# EAGLE board Wordclock (EAGLE 7.2.0), part 1 of 2
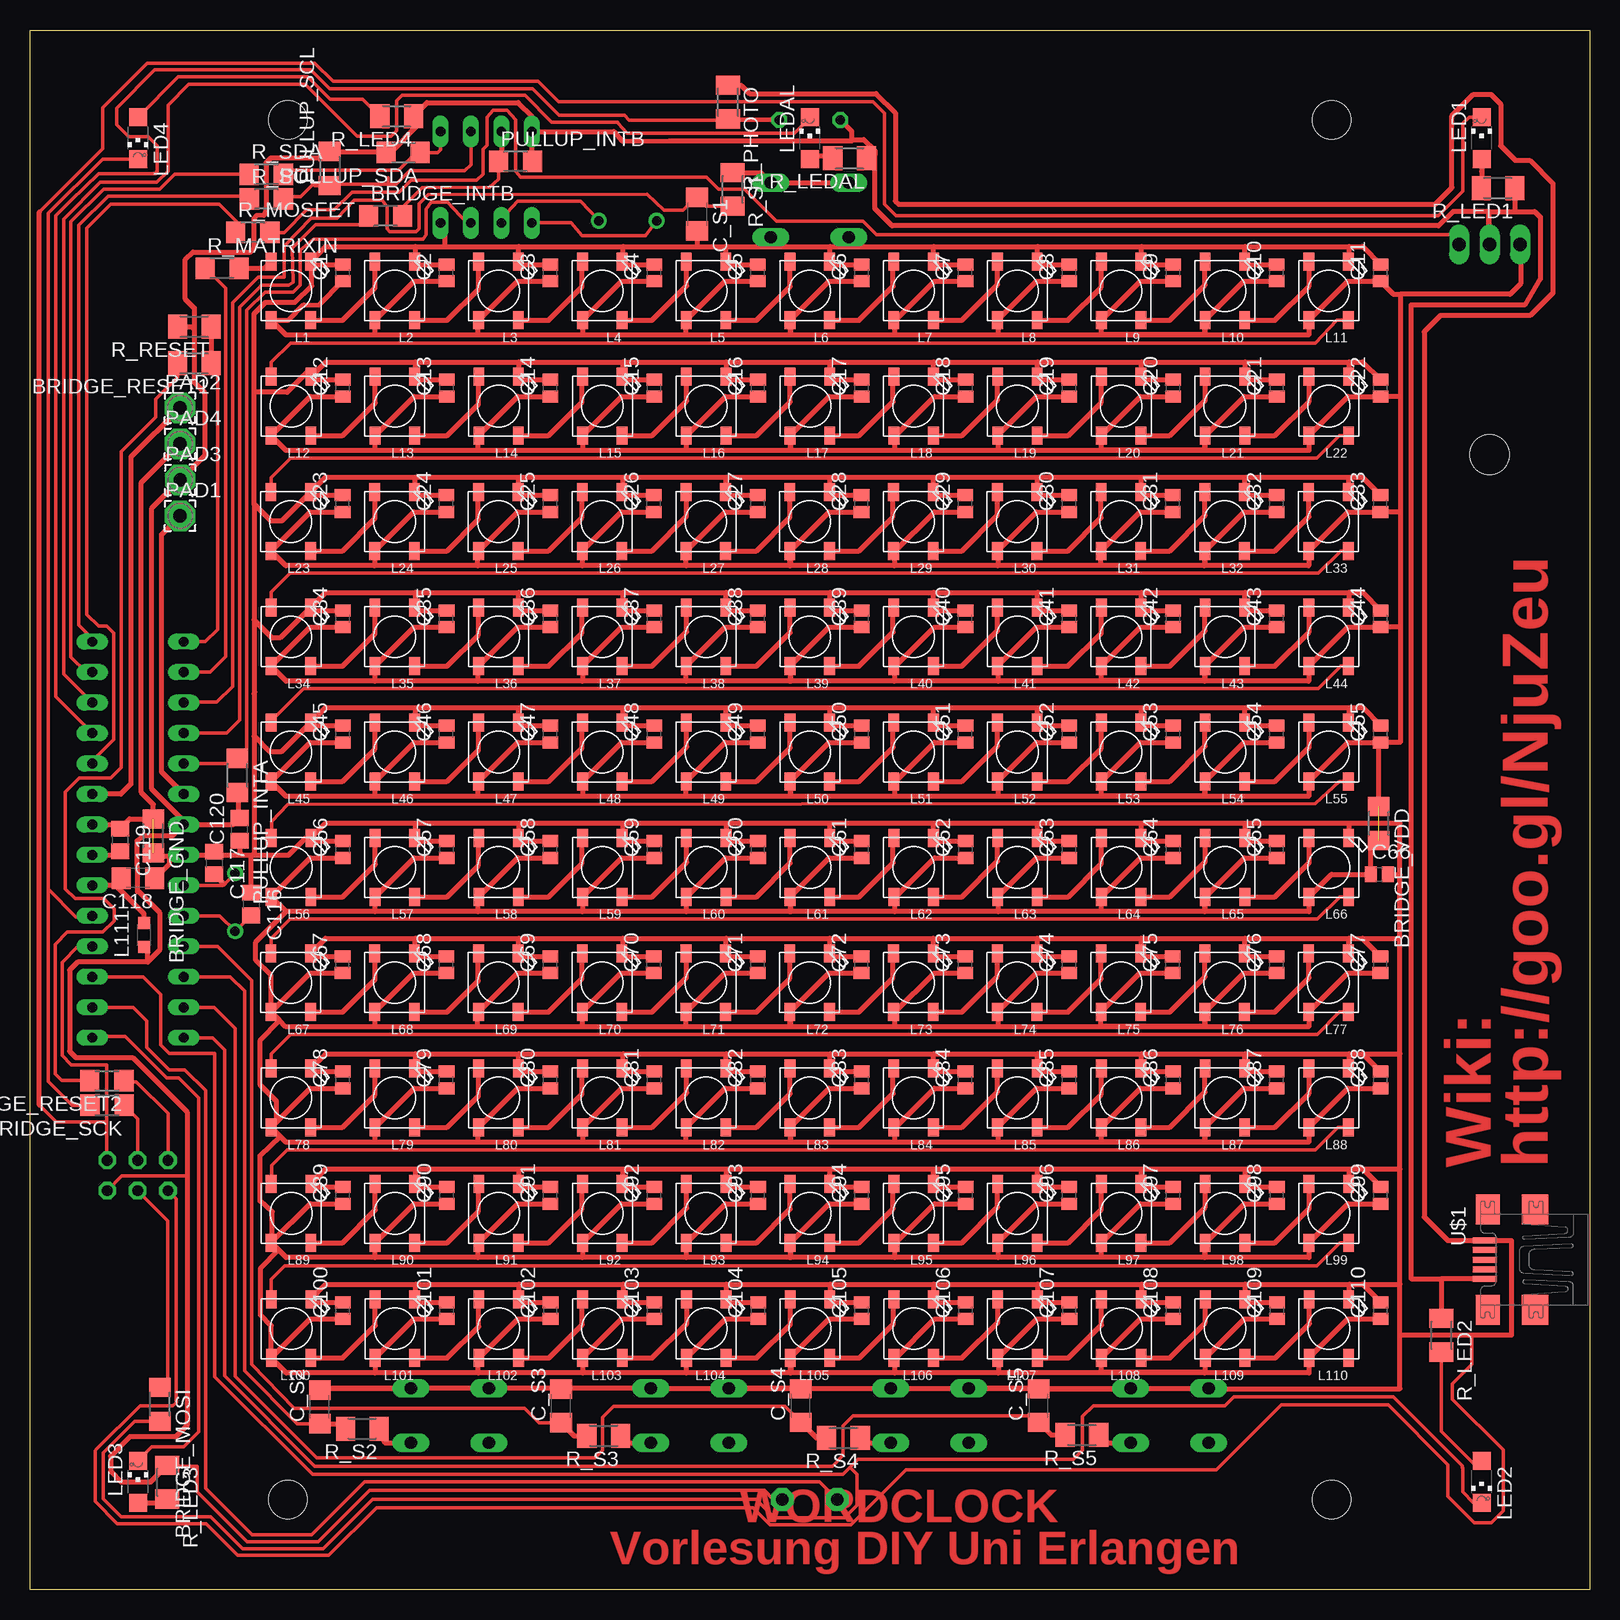
[diagram p1: board, top side]
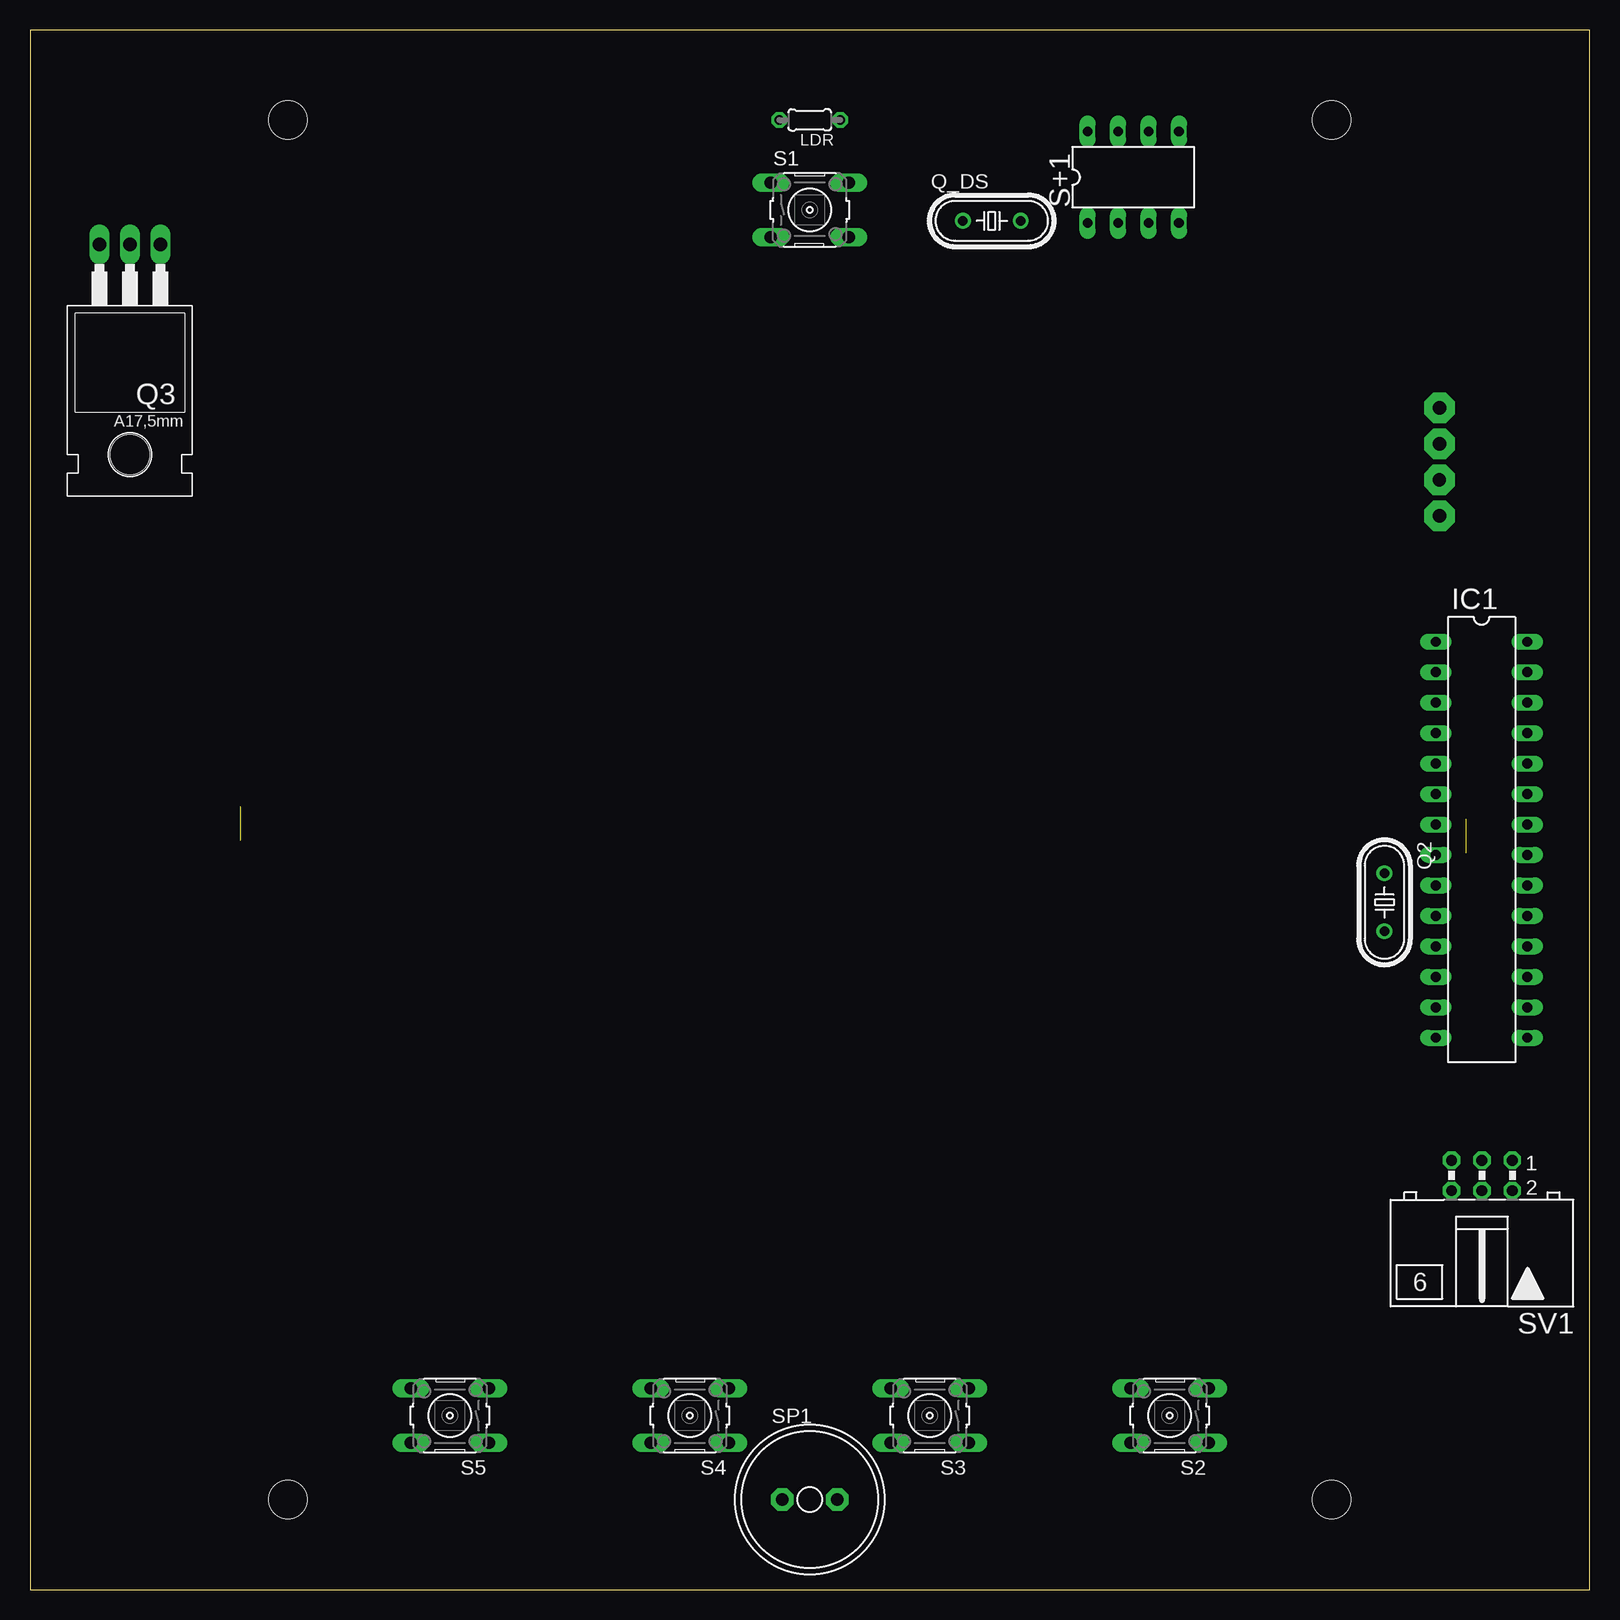
[diagram p2: board, bottom side, seen from below]

Size 130 x 130 mm. Coordinates in mm from the lower left corner, seen from the top.
Outline: 0,0 0,130 130,130 130,0 0,0
Copper layers (1*16): Top 0.035mm / dielectric 1.5mm / Bottom 0.035mm
Design rules "default *": minimum track width 10mil, minimum drill 24mil, track to track 10mil, track to pad 10mil, pad to pad 10mil, via to via 10mil, smd to smd 8mil, copper to edge 30mil, drill to drill 8mil, minimum pad ring 10mil, minimum via ring 8mil, stop-mask expansion 4mil, vias tented up to drill 0mil, thermal gap 10mil
Holes 3.2 mm at 21.5,122.5 108.5,7.5 21.5,7.5 108.5,122.5

## Footprints (pad centres in the part's own frame; a part is rotated, then mirrored left to right if it is on the bottom)
R1206 = smd 1.6 x 1.803: 1 -1.422,0; 2 1.422,0
M1206 = smd 1.6 x 2: 1 -1.4,0; 2 1.4,0
C1310 = smd 1 x 1.3: 1 -0.7,0; 2 0.7,0
C0805 = smd 1.3 x 1.5: 1 -0.95,0; 2 0.95,0
C1206 = smd 1.6 x 1.8: 1 -1.4,0; 2 1.4,0
DIL28-3 = drill 0.813 long: 1 -16.51,-3.81; 2 -13.97,-3.81; 3 -11.43,-3.81; 4 -8.89,-3.81; 5 -6.35,-3.81; 6 -3.81,-3.81; 7 -1.27,-3.81; 8 1.27,-3.81; 9 3.81,-3.81; 10 6.35,-3.81; 11 8.89,-3.81; 12 11.43,-3.81; 13 13.97,-3.81; 14 16.51,-3.81; 15 16.51,3.81; 16 13.97,3.81; 17 11.43,3.81; 18 8.89,3.81; 19 6.35,3.81; 20 3.81,3.81; 21 1.27,3.81; 22 -1.27,3.81; 23 -3.81,3.81; 24 -6.35,3.81; 25 -8.89,3.81; 26 -11.43,3.81; 27 -13.97,3.81; 28 -16.51,3.81
WS2812B = smd 1.5 x 0.9: 1-VDD 2.45,-1.65; 2-DOUT 2.45,1.65; 3-GND -2.45,1.65; 4-DIN -2.45,-1.65
L2012C = smd 1 x 1: 1 -1,0; 2 1,0
0204/5 = drill 0.813 octagon: 1 -2.54,0; 2 2.54,0
CHIPLED_1206 = smd 1.5 x 1.5: A 0,-1.75; C 0,1.75
2,54/1,1 = drill 1.118 pad 2.54 octagon: 1 0,0
HC49/S = drill 0.813: 1 -2.413,0; 2 2.413,0
TO220 = drill 1.118 long: 1 -2.54,-6.35; 2 0,-6.35; 3 2.54,-6.35 | hole 3.302: 0,11.176
B3F-10XX = drill 1.016 long: 1 -3.251,2.261; 2 3.251,2.261; 3 -3.251,-2.261; 4 3.251,-2.261
DIL8 = drill 0.813 long: 1 -3.81,-3.81; 2 -1.27,-3.81; 3 1.27,-3.81; 4 3.81,-3.81; 5 3.81,3.81; 6 1.27,3.81; 7 -1.27,3.81; 8 -3.81,3.81
AL11P = drill 1.016 pad 1.905 octagon: + 2.286,0; - -2.286,0
ML6L = drill 0.914 octagon: 1 -2.54,-1.27; 2 -2.54,1.27; 3 0,-1.27; 4 0,1.27; 5 2.54,-1.27; 6 2.54,1.27
MINI-USB = smd 2 x 0.5: 1 2.25,1.6; 2 2.25,0.8; 3 2.25,0; 4 2.25,-0.8; 5 2.25,-1.6 | smd 2.2 x 2.5: M1 -1.95,-4.2; M2 -1.95,4.2 | smd 2 x 2.5: M3 2,4.2; M4 2,-4.2

## Placement (x,y rotation side)
BRIDGE_GND  0  [R1206]  10.29,62.81 270 top
BRIDGE_INTB  0  [R1206]  29.65,114.5 0 top
BRIDGE_MOSI  0  [R1206]  10.83,15.44 270 top
BRIDGE_RESET1  0  [M1206]  13.7,102.22 180 top
BRIDGE_RESET2  0  [R1206]  6.41,42.42 180 top
BRIDGE_SCK  0  [R1206]  6.42,40.36 180 top
BRIDGE_VDD  0  [R1206]  112.43,63.85 270 top
C1  100n  [C1310]  26.07,109.75 90 top
C2  100n  [C1310]  34.73,109.75 90 top
C3  100n  [C1310]  43.38,109.75 90 top
C4  100n  [C1310]  52.02,109.75 90 top
C5  100n  [C1310]  60.67,109.75 90 top
C6  100n  [C1310]  69.33,109.75 90 top
C7  100n  [C1310]  77.97,109.75 90 top
C8  100n  [C1310]  86.62,109.75 90 top
C9  100n  [C1310]  95.28,109.75 90 top
C10  100n  [C1310]  103.92,109.75 90 top
C11  100n  [C1310]  112.58,109.75 90 top
C12  100n  [C1310]  26.09,100.14 90 top
C13  100n  [C1310]  34.73,100.14 90 top
C14  100n  [C1310]  43.38,100.14 90 top
C15  100n  [C1310]  52.03,100.14 90 top
C16  100n  [C1310]  60.69,100.14 90 top
C17  100n  [C1310]  69.33,100.14 90 top
C18  100n  [C1310]  77.98,100.14 90 top
C19  100n  [C1310]  86.64,100.14 90 top
C20  100n  [C1310]  95.28,100.14 90 top
C21  100n  [C1310]  103.94,100.14 90 top
C22  100n  [C1310]  112.58,100.14 90 top
C23  100n  [C1310]  26.07,90.53 90 top
C24  100n  [C1310]  34.72,90.53 90 top
C25  100n  [C1310]  43.37,90.53 90 top
C26  100n  [C1310]  52.02,90.53 90 top
C27  100n  [C1310]  60.66,90.53 90 top
C28  100n  [C1310]  69.31,90.53 90 top
C29  100n  [C1310]  77.97,90.53 90 top
C30  100n  [C1310]  86.61,90.53 90 top
C31  100n  [C1310]  95.27,90.53 90 top
C32  100n  [C1310]  103.92,90.53 90 top
C33  100n  [C1310]  112.56,90.53 90 top
C34  100n  [C1310]  26.07,80.92 90 top
C35  100n  [C1310]  34.73,80.92 90 top
C36  100n  [C1310]  43.38,80.92 90 top
C37  100n  [C1310]  52.02,80.92 90 top
C38  100n  [C1310]  60.67,80.92 90 top
C39  100n  [C1310]  69.33,80.92 90 top
C40  100n  [C1310]  77.97,80.92 90 top
C41  100n  [C1310]  86.62,80.92 90 top
C42  100n  [C1310]  95.28,80.92 90 top
C43  100n  [C1310]  103.92,80.92 90 top
C44  100n  [C1310]  112.58,80.92 90 top
C45  100n  [C1310]  26.07,71.31 90 top
C46  100n  [C1310]  34.73,71.31 90 top
C47  100n  [C1310]  43.38,71.31 90 top
C48  100n  [C1310]  52.02,71.31 90 top
C49  100n  [C1310]  60.67,71.31 90 top
C50  100n  [C1310]  69.33,71.31 90 top
C51  100n  [C1310]  77.97,71.31 90 top
C52  100n  [C1310]  86.62,71.31 90 top
C53  100n  [C1310]  95.28,71.31 90 top
C54  100n  [C1310]  103.92,71.31 90 top
C55  100n  [C1310]  112.58,71.31 90 top
C56  100n  [C1310]  26.09,61.69 90 top
C57  100n  [C1310]  34.73,61.69 90 top
C58  100n  [C1310]  43.38,61.69 90 top
C59  100n  [C1310]  52.03,61.69 90 top
C60  100n  [C1310]  60.69,61.69 90 top
C61  100n  [C1310]  69.33,61.69 90 top
C62  100n  [C1310]  77.98,61.69 90 top
C63  100n  [C1310]  86.64,61.69 90 top
C64  100n  [C1310]  95.28,61.69 90 top
C65  100n  [C1310]  103.94,61.69 90 top
C66  100n  [C1310]  112.47,59.62 0 top
C67  100n  [C1310]  26.07,52.09 90 top
C68  100n  [C1310]  34.72,52.09 90 top
C69  100n  [C1310]  43.37,52.09 90 top
C70  100n  [C1310]  52.02,52.09 90 top
C71  100n  [C1310]  60.66,52.09 90 top
C72  100n  [C1310]  69.31,52.09 90 top
C73  100n  [C1310]  77.97,52.09 90 top
C74  100n  [C1310]  86.61,52.09 90 top
C75  100n  [C1310]  95.27,52.09 90 top
C76  100n  [C1310]  103.92,52.09 90 top
C77  100n  [C1310]  112.56,52.09 90 top
C78  100n  [C1310]  26.07,42.47 90 top
C79  100n  [C1310]  34.73,42.47 90 top
C80  100n  [C1310]  43.38,42.47 90 top
C81  100n  [C1310]  52.02,42.47 90 top
C82  100n  [C1310]  60.67,42.47 90 top
C83  100n  [C1310]  69.33,42.47 90 top
C84  100n  [C1310]  77.97,42.47 90 top
C85  100n  [C1310]  86.62,42.47 90 top
C86  100n  [C1310]  95.28,42.47 90 top
C87  100n  [C1310]  103.92,42.47 90 top
C88  100n  [C1310]  112.58,42.47 90 top
C89  100n  [C1310]  26.09,32.87 90 top
C90  100n  [C1310]  34.73,32.87 90 top
C91  100n  [C1310]  43.38,32.87 90 top
C92  100n  [C1310]  52.03,32.87 90 top
C93  100n  [C1310]  60.69,32.87 90 top
C94  100n  [C1310]  69.33,32.87 90 top
C95  100n  [C1310]  77.98,32.87 90 top
C96  100n  [C1310]  86.64,32.87 90 top
C97  100n  [C1310]  95.28,32.87 90 top
C98  100n  [C1310]  103.94,32.87 90 top
C99  100n  [C1310]  112.58,32.87 90 top
C100  100n  [C1310]  26.09,23.25 90 top
C101  100n  [C1310]  34.74,23.25 90 top
C102  100n  [C1310]  43.4,23.25 90 top
C103  100n  [C1310]  52.05,23.25 90 top
C104  100n  [C1310]  60.7,23.25 90 top
C105  100n  [C1310]  69.34,23.25 90 top
C106  100n  [C1310]  78,23.25 90 top
C107  100n  [C1310]  86.64,23.25 90 top
C108  100n  [C1310]  95.3,23.25 90 top
C109  100n  [C1310]  103.94,23.25 90 top
C110  100n  [C1310]  112.59,23.25 90 top
C116  15p  [C0805]  18.44,57.14 270 top
C117  15p  [C0805]  15.36,60.56 270 top
C118  100n  [C1206]  9,59.3 180 top
C119  100n  [C0805]  7.5,62.48 270 top
C120  100n  [C0805]  17.47,63.36 90 top
C_S1  100n  [C1206]  55.6,114.65 270 top
C_S2  100n  [C1206]  24.15,15.23 90 top
C_S3  100n  [C1206]  44.27,15.31 90 top
C_S4  100n  [C1206]  64.25,15.34 90 top
C_S5  100n  [C1206]  84.08,15.33 90 top
IC1  MEGA8-P  [DIL28-3]  9,62.5 270 bottom
L1  WS2812B  [WS2812B]  21.75,108.25 270 top
L2  WS2812B  [WS2812B]  30.4,108.25 270 top
L3  WS2812B  [WS2812B]  39.05,108.25 270 top
L4  WS2812B  [WS2812B]  47.7,108.25 270 top
L5  WS2812B  [WS2812B]  56.35,108.25 270 top
L6  WS2812B  [WS2812B]  65,108.25 270 top
L7  WS2812B  [WS2812B]  73.65,108.25 270 top
L8  WS2812B  [WS2812B]  82.3,108.25 270 top
L9  WS2812B  [WS2812B]  90.95,108.25 270 top
L10  WS2812B  [WS2812B]  99.6,108.25 270 top
L11  WS2812B  [WS2812B]  108.25,108.25 270 top
L12  WS2812B  [WS2812B]  21.76,98.64 270 top
L13  WS2812B  [WS2812B]  30.41,98.64 270 top
L14  WS2812B  [WS2812B]  39.06,98.64 270 top
L15  WS2812B  [WS2812B]  47.71,98.64 270 top
L16  WS2812B  [WS2812B]  56.36,98.64 270 top
L17  WS2812B  [WS2812B]  65.01,98.64 270 top
L18  WS2812B  [WS2812B]  73.66,98.64 270 top
L19  WS2812B  [WS2812B]  82.31,98.64 270 top
L20  WS2812B  [WS2812B]  90.96,98.64 270 top
L21  WS2812B  [WS2812B]  99.61,98.64 270 top
L22  WS2812B  [WS2812B]  108.26,98.64 270 top
L23  WS2812B  [WS2812B]  21.74,89.03 270 top
L24  WS2812B  [WS2812B]  30.39,89.03 270 top
L25  WS2812B  [WS2812B]  39.04,89.03 270 top
L26  WS2812B  [WS2812B]  47.69,89.03 270 top
L27  WS2812B  [WS2812B]  56.34,89.03 270 top
L28  WS2812B  [WS2812B]  64.99,89.03 270 top
L29  WS2812B  [WS2812B]  73.64,89.03 270 top
L30  WS2812B  [WS2812B]  82.29,89.03 270 top
L31  WS2812B  [WS2812B]  90.94,89.03 270 top
L32  WS2812B  [WS2812B]  99.59,89.03 270 top
L33  WS2812B  [WS2812B]  108.24,89.03 270 top
L34  WS2812B  [WS2812B]  21.75,79.42 270 top
L35  WS2812B  [WS2812B]  30.4,79.42 270 top
L36  WS2812B  [WS2812B]  39.05,79.42 270 top
L37  WS2812B  [WS2812B]  47.7,79.42 270 top
L38  WS2812B  [WS2812B]  56.35,79.42 270 top
L39  WS2812B  [WS2812B]  65,79.42 270 top
L40  WS2812B  [WS2812B]  73.65,79.42 270 top
L41  WS2812B  [WS2812B]  82.3,79.42 270 top
L42  WS2812B  [WS2812B]  90.95,79.42 270 top
L43  WS2812B  [WS2812B]  99.6,79.42 270 top
L44  WS2812B  [WS2812B]  108.25,79.42 270 top
L45  WS2812B  [WS2812B]  21.75,69.81 270 top
L46  WS2812B  [WS2812B]  30.4,69.81 270 top
L47  WS2812B  [WS2812B]  39.05,69.81 270 top
L48  WS2812B  [WS2812B]  47.7,69.81 270 top
L49  WS2812B  [WS2812B]  56.35,69.81 270 top
L50  WS2812B  [WS2812B]  65,69.81 270 top
L51  WS2812B  [WS2812B]  73.65,69.81 270 top
L52  WS2812B  [WS2812B]  82.3,69.81 270 top
L53  WS2812B  [WS2812B]  90.95,69.81 270 top
L54  WS2812B  [WS2812B]  99.6,69.81 270 top
L55  WS2812B  [WS2812B]  108.25,69.81 270 top
L56  WS2812B  [WS2812B]  21.76,60.19 270 top
L57  WS2812B  [WS2812B]  30.41,60.19 270 top
L58  WS2812B  [WS2812B]  39.06,60.19 270 top
L59  WS2812B  [WS2812B]  47.71,60.19 270 top
L60  WS2812B  [WS2812B]  56.36,60.19 270 top
L61  WS2812B  [WS2812B]  65.01,60.19 270 top
L62  WS2812B  [WS2812B]  73.66,60.19 270 top
L63  WS2812B  [WS2812B]  82.31,60.19 270 top
L64  WS2812B  [WS2812B]  90.96,60.19 270 top
L65  WS2812B  [WS2812B]  99.61,60.19 270 top
L66  WS2812B  [WS2812B]  108.26,60.19 270 top
L67  WS2812B  [WS2812B]  21.74,50.59 270 top
L68  WS2812B  [WS2812B]  30.39,50.59 270 top
L69  WS2812B  [WS2812B]  39.04,50.59 270 top
L70  WS2812B  [WS2812B]  47.69,50.59 270 top
L71  WS2812B  [WS2812B]  56.34,50.59 270 top
L72  WS2812B  [WS2812B]  64.99,50.59 270 top
L73  WS2812B  [WS2812B]  73.64,50.59 270 top
L74  WS2812B  [WS2812B]  82.29,50.59 270 top
L75  WS2812B  [WS2812B]  90.94,50.59 270 top
L76  WS2812B  [WS2812B]  99.59,50.59 270 top
L77  WS2812B  [WS2812B]  108.24,50.59 270 top
L78  WS2812B  [WS2812B]  21.75,40.97 270 top
L79  WS2812B  [WS2812B]  30.4,40.97 270 top
L80  WS2812B  [WS2812B]  39.05,40.97 270 top
L81  WS2812B  [WS2812B]  47.7,40.97 270 top
L82  WS2812B  [WS2812B]  56.35,40.97 270 top
L83  WS2812B  [WS2812B]  65,40.97 270 top
L84  WS2812B  [WS2812B]  73.65,40.97 270 top
L85  WS2812B  [WS2812B]  82.3,40.97 270 top
L86  WS2812B  [WS2812B]  90.95,40.97 270 top
L87  WS2812B  [WS2812B]  99.6,40.97 270 top
L88  WS2812B  [WS2812B]  108.25,40.97 270 top
L89  WS2812B  [WS2812B]  21.76,31.37 270 top
L90  WS2812B  [WS2812B]  30.41,31.37 270 top
L91  WS2812B  [WS2812B]  39.06,31.37 270 top
L92  WS2812B  [WS2812B]  47.71,31.37 270 top
L93  WS2812B  [WS2812B]  56.36,31.37 270 top
L94  WS2812B  [WS2812B]  65.01,31.37 270 top
L95  WS2812B  [WS2812B]  73.66,31.37 270 top
L96  WS2812B  [WS2812B]  82.31,31.37 270 top
L97  WS2812B  [WS2812B]  90.96,31.37 270 top
L98  WS2812B  [WS2812B]  99.61,31.37 270 top
L99  WS2812B  [WS2812B]  108.26,31.37 270 top
L100  WS2812B  [WS2812B]  21.77,21.75 270 top
L101  WS2812B  [WS2812B]  30.42,21.75 270 top
L102  WS2812B  [WS2812B]  39.07,21.75 270 top
L103  WS2812B  [WS2812B]  47.72,21.75 270 top
L104  WS2812B  [WS2812B]  56.37,21.75 270 top
L105  WS2812B  [WS2812B]  65.02,21.75 270 top
L106  WS2812B  [WS2812B]  73.67,21.75 270 top
L107  WS2812B  [WS2812B]  82.32,21.75 270 top
L108  WS2812B  [WS2812B]  90.97,21.75 270 top
L109  WS2812B  [WS2812B]  99.62,21.75 270 top
L110  WS2812B  [WS2812B]  108.27,21.75 270 top
L111  10u  [L2012C]  9.52,54.56 90 top
LDR  [0204/5]  65,122.5 180 bottom
LED1  [CHIPLED_1206]  121,121 0 top
LED2  [CHIPLED_1206]  121,9 180 top
LED3  [CHIPLED_1206]  9,9 0 top
LED4  [CHIPLED_1206]  9,121 180 top
LEDAL  [CHIPLED_1206]  65,121 0 top
PAD1  [2,54/1,1]  12.51,89.5 0 top
PAD2  [2,54/1,1]  12.5,98.5 0 top
PAD3  [2,54/1,1]  12.52,92.5 0 top
PAD4  [2,54/1,1]  12.51,95.51 0 top
PULLUP_INTA  4,7k  [R1206]  17.3,67.87 270 top
PULLUP_INTB  4,7k  [R1206]  40.48,119.03 0 top
PULLUP_SCL  4,7k  [R1206]  24.98,118.45 90 top
PULLUP_SDA  4,7k  [R1206]  31.1,119.78 180 top
Q2  [HC49/S]  17.09,57.29 270 bottom
Q3  SUP75N06-08  [TO220]  121.67,105.77 180 bottom
Q_DS  32,768MHz  [HC49/S]  49.83,114.09 0 bottom
R_LED1  120  [M1206]  122.37,116.83 180 top
R_LED2  120  [M1206]  117.66,21.2 270 top
R_LED3  120  [M1206]  11.45,8.95 270 top
R_LED4  120  [M1206]  30.57,122.81 180 top
R_LEDAL  120  [M1206]  68.32,119.31 180 top
R_MATRIXIN  300  [R1206]  16.02,110.14 0 top
R_MOSFET  130  [R1206]  18.58,113.12 0 top
R_PHOTO  49,9k  [M1206]  58.18,123.99 270 top
R_RESET  10k  [M1206]  13.7,105.27 180 top
R_S1  1k  [M1206]  58.57,116.71 270 top
R_S2  1k  [M1206]  27.7,13.41 180 top
R_S3  1k  [M1206]  47.82,12.81 180 top
R_S4  1k  [M1206]  67.8,12.64 180 top
R_S5  1k  [M1206]  87.69,12.88 180 top
R_SCL  0  [R1206]  19.71,115.91 0 top
R_SDA  0  [R1206]  19.7,117.97 0 top
S1  [B3F-10XX]  65,115 0 bottom
S2  [B3F-10XX]  35,14.5 180 bottom
S3  [B3F-10XX]  55,14.5 180 bottom
S4  [B3F-10XX]  75,14.5 180 bottom
S5  [B3F-10XX]  95,14.5 180 bottom
S+1  DS1337+  [DIL8]  38.03,117.73 0 bottom
SP1  AL11P  [AL11P]  65,7.5 0 bottom
SV1  [ML6L]  8.96,34.52 180 bottom
U$1  MINI-USB  [MINI-USB]  123.5,27.5 180 top